# Altium schematic sheet GPIOExpander.SchDoc: ArduIMU V4 GPIO Expander
size A4; DrawnBy: J.F.B; Revision: 3; SheetNumber: 1; SheetTotal: 1; ProjectName: ECE4600 Design Project
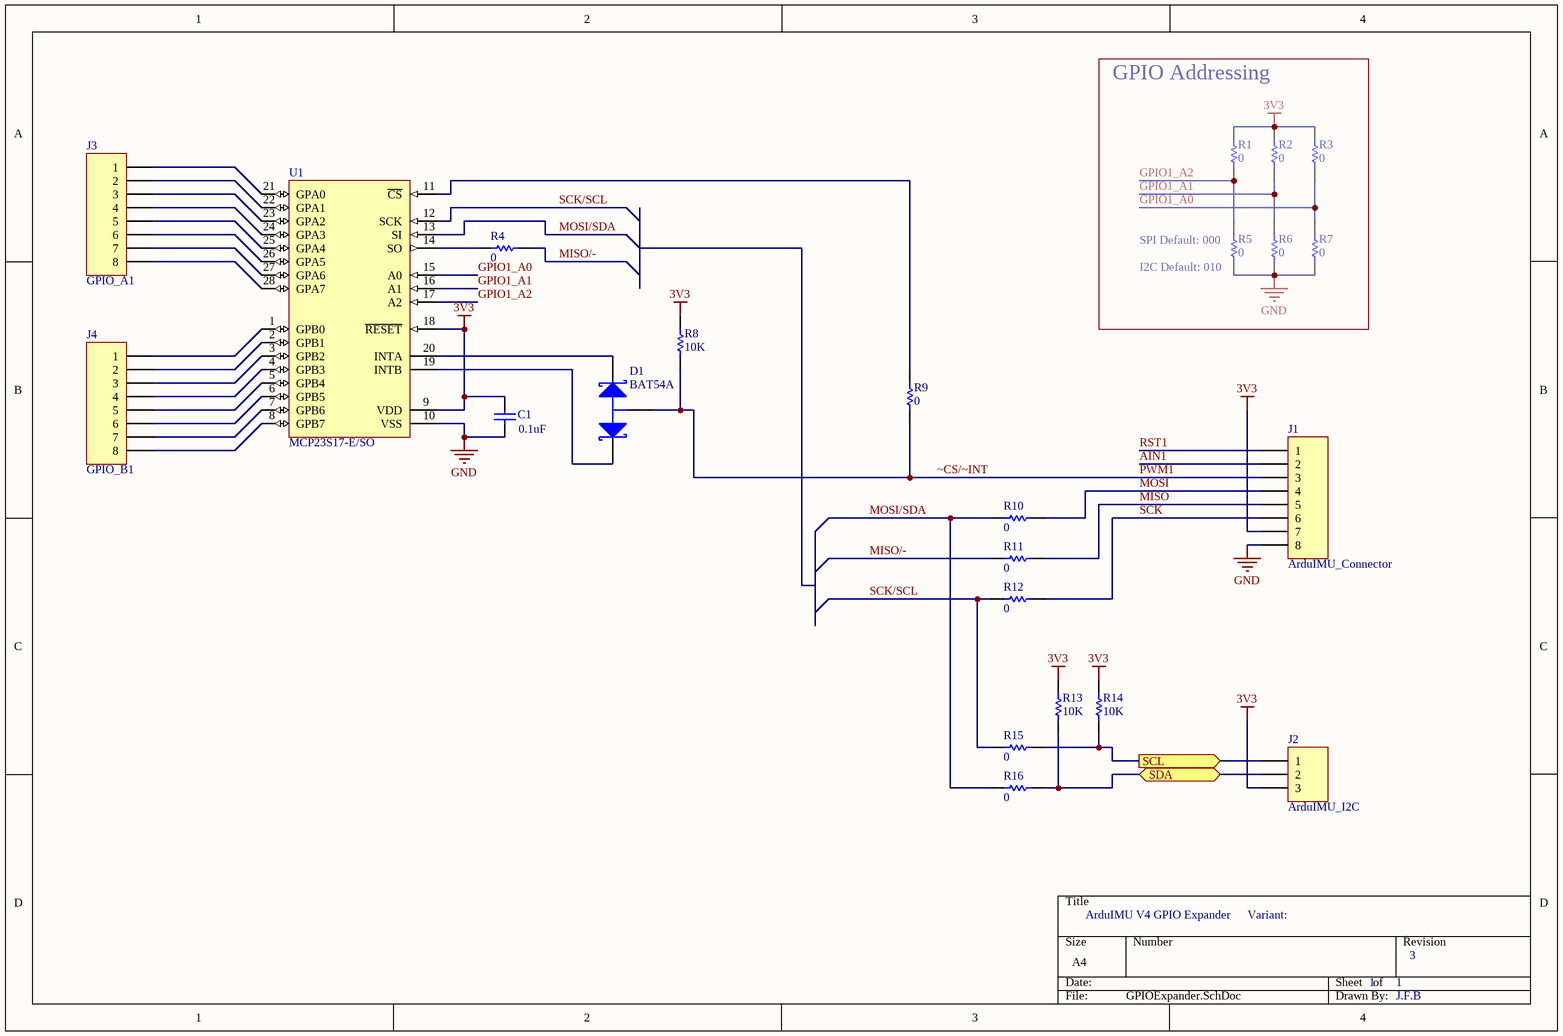
[diagram p0: GPIOExpander.SchDoc]

## Parts
C1  value 0.1uF  [6-0805]  (hidden comment: Cap)
D1  BAT54A  [SOT23_N]
J1  ArduIMU_Connector  [HDR1X8]
J2  ArduIMU_I2C  [HDR1X3]
J3  GPIO_A1  [HDR1X8]
J4  GPIO_B1  [HDR1X8]
R1  0  [6-0805]
R2  0  [6-0805]
R3  0  [6-0805]
R4  0  [6-0805]
R5  0  [6-0805]
R6  0  [6-0805]
R7  0  [6-0805]
R8  10K  [8-1206]
R9  0  [6-0805]
R10  0  [6-0805]
R11  0  [6-0805]
R12  0  [6-0805]
R13  10K  [8-1206]
R14  10K  [8-1206]
R15  0  [6-0805]
R16  0  [6-0805]
U1  MCP23S17-E/SO  [SOIC-SO28_N]

## Blocks framed on the sheet
GPIO Addressing: R1-R3 R5-R7

## Ports
SCL (out), SDA (bidir)

## Nets
3V3: C1.2 J1.7 J2.3 R1.2 R2.2 R3.2 R8.1 R13.1 R14.1 U1.9(VDD) U1.18(~{RESET})
GND: C1.1 J1.8 R5.1 R6.1 R7.1 U1.10(VSS)
AIN1: J1.2
GPIO1_A0: R3.1 R7.2 U1.15(A0)
GPIO1_A1: R2.1 R6.2 U1.16(A1)
GPIO1_A2: R1.1 R5.2 U1.17(A2)
MISO: J1.5 R11.2
MISO/-: R4.2 R11.1
MOSI: J1.4 R10.2
MOSI/SDA: R10.1 R16.1 U1.13(SI)
PWM1: D1.3(A) J1.3 R8.2 R9.1  [also labelled ~CS/~INT]
RST1: J1.1
SCK: J1.6 R12.2
SCK/SCL: R12.1 R15.1 U1.12(SCK)
SCL: J2.1 R14.2 R15.2 ; port SCL
SDA: J2.2 R13.2 R16.2 ; port SDA
NetD1_1: D1.1(K1) U1.20(INTA)
NetD1_2: D1.2(K2) U1.19(INTB)
NetJ3_1: J3.1 U1.21(GPA0)
NetJ3_2: J3.2 U1.22(GPA1)
NetJ3_3: J3.3 U1.23(GPA2)
NetJ3_4: J3.4 U1.24(GPA3)
NetJ3_5: J3.5 U1.25(GPA4)
NetJ3_6: J3.6 U1.26(GPA5)
NetJ3_7: J3.7 U1.27(GPA6)
NetJ3_8: J3.8 U1.28(GPA7)
NetJ4_1: J4.1 U1.1(GPB0)
NetJ4_2: J4.2 U1.2(GPB1)
NetJ4_3: J4.3 U1.3(GPB2)
NetJ4_4: J4.4 U1.4(GPB3)
NetJ4_5: J4.5 U1.5(GPB4)
NetJ4_6: J4.6 U1.6(GPB5)
NetJ4_7: J4.7 U1.7(GPB6)
NetJ4_8: J4.8 U1.8(GPB7)
NetR4_1: R4.1 U1.14(SO)
NetR9_2: R9.2 U1.11(~{CS})

## Notes on the sheet
- (near R5) SPI Default: 000
- (near R5) I2C Default: 010
- Variant:

## Library data of the parts
C1 = Cap: Capacitor; Published: 8-Jun-2000; LatestRevisionDate: 17-Jul-2002; LatestRevisionNote: Re-released for DXP Platform.; PackageReference: RAD-0.3; Publisher: Altium Limited; PackageDescription: Radial Cap, Thru-Hole; 2 Leads; 0.3 in Pin Spacing
D1 = BAT54A: Schottky Barrier Double Diode; Published: 17-Sep-2003; LatestRevisionDate: 12-Dec-2006; LatestRevisionNote: IPC-7351 Footprint Added.; DatasheetVersion: 4-Mar-2002; PackageVersion: May-1999; PackageReference: SOT23; Publisher: Altium Limited; PackageDescription: 3-Pin SOT-23 Package 0.95 mm Pitch, 2.3 mm Lead Span; ComponentLink1Description: Manufacturer Link; ComponentLink1URL: http://www.semiconductors.philips.com/; ComponentLink2Description: Datasheet; ComponentLink2URL: http://www.semiconductors.philips.com/acrobat/datasheets/BAT54_SERIES_4.pdf
J1 J3 J4 = Header 8: Header, 8-Pin; LatestRevisionDate: 17-Jul-2002; LatestRevisionNote: Re-released for DXP Platform.; Publisher: Altium Limited
J2 = Header 3: Header, 3-Pin; LatestRevisionDate: 17-Jul-2002; LatestRevisionNote: Re-released for DXP Platform.; Publisher: Altium Limited
R1-R7 R9-R12 R15 R16 = ERJ6GE: Thick Film Chip Resistor, 1 Ohm to 10M Ohm Range, 5% Tolerance, 0805 Size, 0.125 W; Note: If flow soldering, adjust pad width of PCB Footprint to 0.7 - 0.8 times the width of the resistor.; Published: 17-Dec-2003; LatestRevisionDate: 19-Mar-2004; LatestRevisionNote: Silkscreen size reduced.; PackageDocument: Mar-2003; PackageReference: 6-0805; Publisher: Altium Limited; Code_IPC: 2012 [0805]; ComponentLink1Description: Manufacturer Link; ComponentLink1URL: http://www.panasonic.com/industrial/components/resistive_products.htm; ComponentLink2Description: Datasheet; ComponentLink2URL: http://www.panasonic.com/industrial/components/pdf/AOA0000CE1.pdf
R8 R13 R14 = ERJ8GE: Thick Film Chip Resistor, 1 Ohm to 10M Ohm Range, 5% Tolerance, 1206 Size, 0.25 W; Note: If flow soldering, adjust pad width of PCB Footprint to 0.7 - 0.8 times the width of the resistor.; Published: 17-Dec-2003; LatestRevisionDate: 19-Mar-2004; LatestRevisionNote: Silkscreen size reduced.; PackageDocument: Mar-2003; PackageReference: 8-1206; Publisher: Altium Limited; Code_IPC: 3216 [1206]; ComponentLink1Description: Manufacturer Link; ComponentLink1URL: http://www.panasonic.com/industrial/components/resistive_products.htm; ComponentLink2Description: Datasheet; ComponentLink2URL: http://www.panasonic.com/industrial/components/pdf/AOA0000CE1.pdf
U1 = MCP23S17-E/SO: 16-Bit I/O Expander with Serial Interface, 28-Pin SOIC, Extended Temperature; Published: 29-Jan-2009; DatasheetVersion: revB, Feb-2007; PackageVersion: revBB, Aug-2009; PackageReference: SOIC-SO28; Publisher: Altium Limited; PackageDescription: 28-Lead Plastic Small Outline (SO) - Wide 7.50mm Body [SOIC]; Supplier 1: Digi-Key; Supplier Part Number 1: MCP23S17-E/SO-ND; Supplier 2: Farnell; Supplier Part Number 2: 1332093; Code_JEDEC: MS-013; ComponentLink1Description: Datasheet; ComponentLink1URL: http://ww1.microchip.com/downloads/en/DeviceDoc/21952b.pdf; ComponentLink2Description: Packaging Specification; ComponentLink2URL: http://www.microchip.com/stellent/groups/techpub_sg/documents/packagingspec/en012702.pdf; ComponentLink3Description: Microchip.com Home; ComponentLink3URL: http://www.microchip.com/